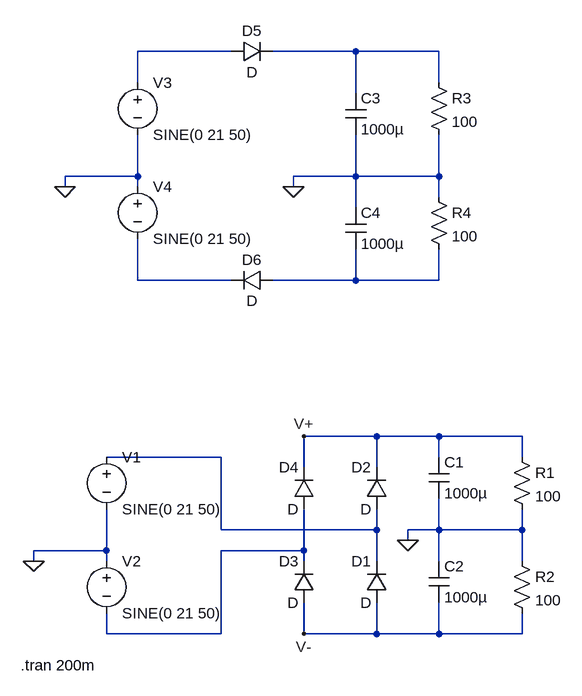
[diagram p0: schematic Rectifier comparison.asc]
Rectifier comparison.asc, the LTspice schematic file:
Version 4
SHEET 1 880 680
WIRE 32 -544 -112 -544
WIRE 224 -544 96 -544
WIRE 352 -544 224 -544
WIRE -112 -496 -112 -544
WIRE 352 -496 352 -544
WIRE 224 -480 224 -544
WIRE -112 -352 -112 -416
WIRE -112 -352 -224 -352
WIRE 224 -352 224 -416
WIRE 224 -352 128 -352
WIRE 352 -352 352 -416
WIRE 352 -352 224 -352
WIRE -224 -336 -224 -352
WIRE -112 -336 -112 -352
WIRE 128 -336 128 -352
WIRE 352 -320 352 -352
WIRE 224 -304 224 -352
WIRE -112 -192 -112 -256
WIRE 32 -192 -112 -192
WIRE 224 -192 224 -240
WIRE 224 -192 96 -192
WIRE 352 -192 352 -240
WIRE 352 -192 224 -192
WIRE 256 48 144 48
WIRE 352 48 256 48
WIRE 480 48 352 48
WIRE 16 80 -160 80
WIRE 352 80 352 48
WIRE 480 80 480 48
WIRE 144 96 144 48
WIRE 256 96 256 48
WIRE 16 192 16 80
WIRE 256 192 256 160
WIRE 256 192 16 192
WIRE 352 192 352 144
WIRE 352 192 304 192
WIRE 480 192 480 160
WIRE 480 192 352 192
WIRE 304 208 304 192
WIRE -160 224 -160 160
WIRE -160 224 -272 224
WIRE 144 224 144 160
WIRE 144 224 16 224
WIRE -272 240 -272 224
WIRE -160 240 -160 224
WIRE 144 240 144 224
WIRE 256 240 256 192
WIRE 352 240 352 192
WIRE 480 240 480 192
WIRE -160 352 -160 320
WIRE 16 352 16 224
WIRE 16 352 -160 352
WIRE 144 352 144 304
WIRE 256 352 256 304
WIRE 256 352 144 352
WIRE 352 352 352 304
WIRE 352 352 256 352
WIRE 480 352 480 320
WIRE 480 352 352 352
FLAG -272 240 0
FLAG 304 208 0
FLAG 144 48 V+
FLAG 144 352 V-
FLAG -224 -336 0
FLAG 128 -336 0
SYMBOL diode 272 304 R180
WINDOW 0 24 64 Left 2
WINDOW 3 24 0 Left 2
SYMATTR InstName D1
SYMBOL diode 272 160 R180
WINDOW 0 24 64 Left 2
WINDOW 3 24 0 Left 2
SYMATTR InstName D2
SYMBOL diode 160 304 R180
WINDOW 0 24 64 Left 2
WINDOW 3 24 0 Left 2
SYMATTR InstName D3
SYMBOL diode 160 160 R180
WINDOW 0 24 64 Left 2
WINDOW 3 24 0 Left 2
SYMATTR InstName D4
SYMBOL voltage -160 64 R0
WINDOW 123 0 0 Left 0
WINDOW 39 0 0 Left 0
SYMATTR InstName V1
SYMATTR Value SINE(0 21 50)
SYMBOL voltage -160 224 R0
WINDOW 123 0 0 Left 0
WINDOW 39 0 0 Left 0
SYMATTR InstName V2
SYMATTR Value SINE(0 21 50)
SYMBOL cap 336 80 R0
SYMATTR InstName C1
SYMATTR Value 1000µ
SYMBOL cap 336 240 R0
SYMATTR InstName C2
SYMATTR Value 1000µ
SYMBOL res 464 64 R0
SYMATTR InstName R1
SYMATTR Value 100
SYMBOL res 464 224 R0
SYMATTR InstName R2
SYMATTR Value 100
SYMBOL voltage -112 -512 R0
WINDOW 123 0 0 Left 0
WINDOW 39 0 0 Left 0
SYMATTR InstName V3
SYMATTR Value SINE(0 21 50)
SYMBOL voltage -112 -352 R0
WINDOW 123 0 0 Left 0
WINDOW 39 0 0 Left 0
SYMATTR InstName V4
SYMATTR Value SINE(0 21 50)
SYMBOL diode 32 -528 R270
WINDOW 0 32 32 VTop 2
WINDOW 3 0 32 VBottom 2
SYMATTR InstName D5
SYMBOL diode 96 -208 R90
WINDOW 0 0 32 VBottom 2
WINDOW 3 32 32 VTop 2
SYMATTR InstName D6
SYMBOL cap 208 -480 R0
SYMATTR InstName C3
SYMATTR Value 1000µ
SYMBOL cap 208 -304 R0
SYMATTR InstName C4
SYMATTR Value 1000µ
SYMBOL res 336 -512 R0
SYMATTR InstName R3
SYMATTR Value 100
SYMBOL res 336 -336 R0
SYMATTR InstName R4
SYMATTR Value 100
TEXT -292 400 Left 2 !.tran 200m

The netlist it stands for:
* Rectifier comparison.asc
D1 V- N005 D
D2 N005 V+ D
D3 V- N006 D
D4 N006 V+ D
V1 N005 0 SINE(0 21 50)
V2 0 N006 SINE(0 21 50)
C1 V+ 0 1000µ
C2 0 V- 1000µ
R1 V+ 0 100
R2 0 V- 100
V3 N001 0 SINE(0 21 50)
V4 0 N003 SINE(0 21 50)
D5 N001 N002 D
D6 N004 N003 D
C3 N002 0 1000µ
C4 0 N004 1000µ
R3 N002 0 100
R4 0 N004 100
.model D D
.lib standard.dio
.tran 200m
.backanno
.end